# Altium schematic sheet Sheet164.SchDoc
size A2
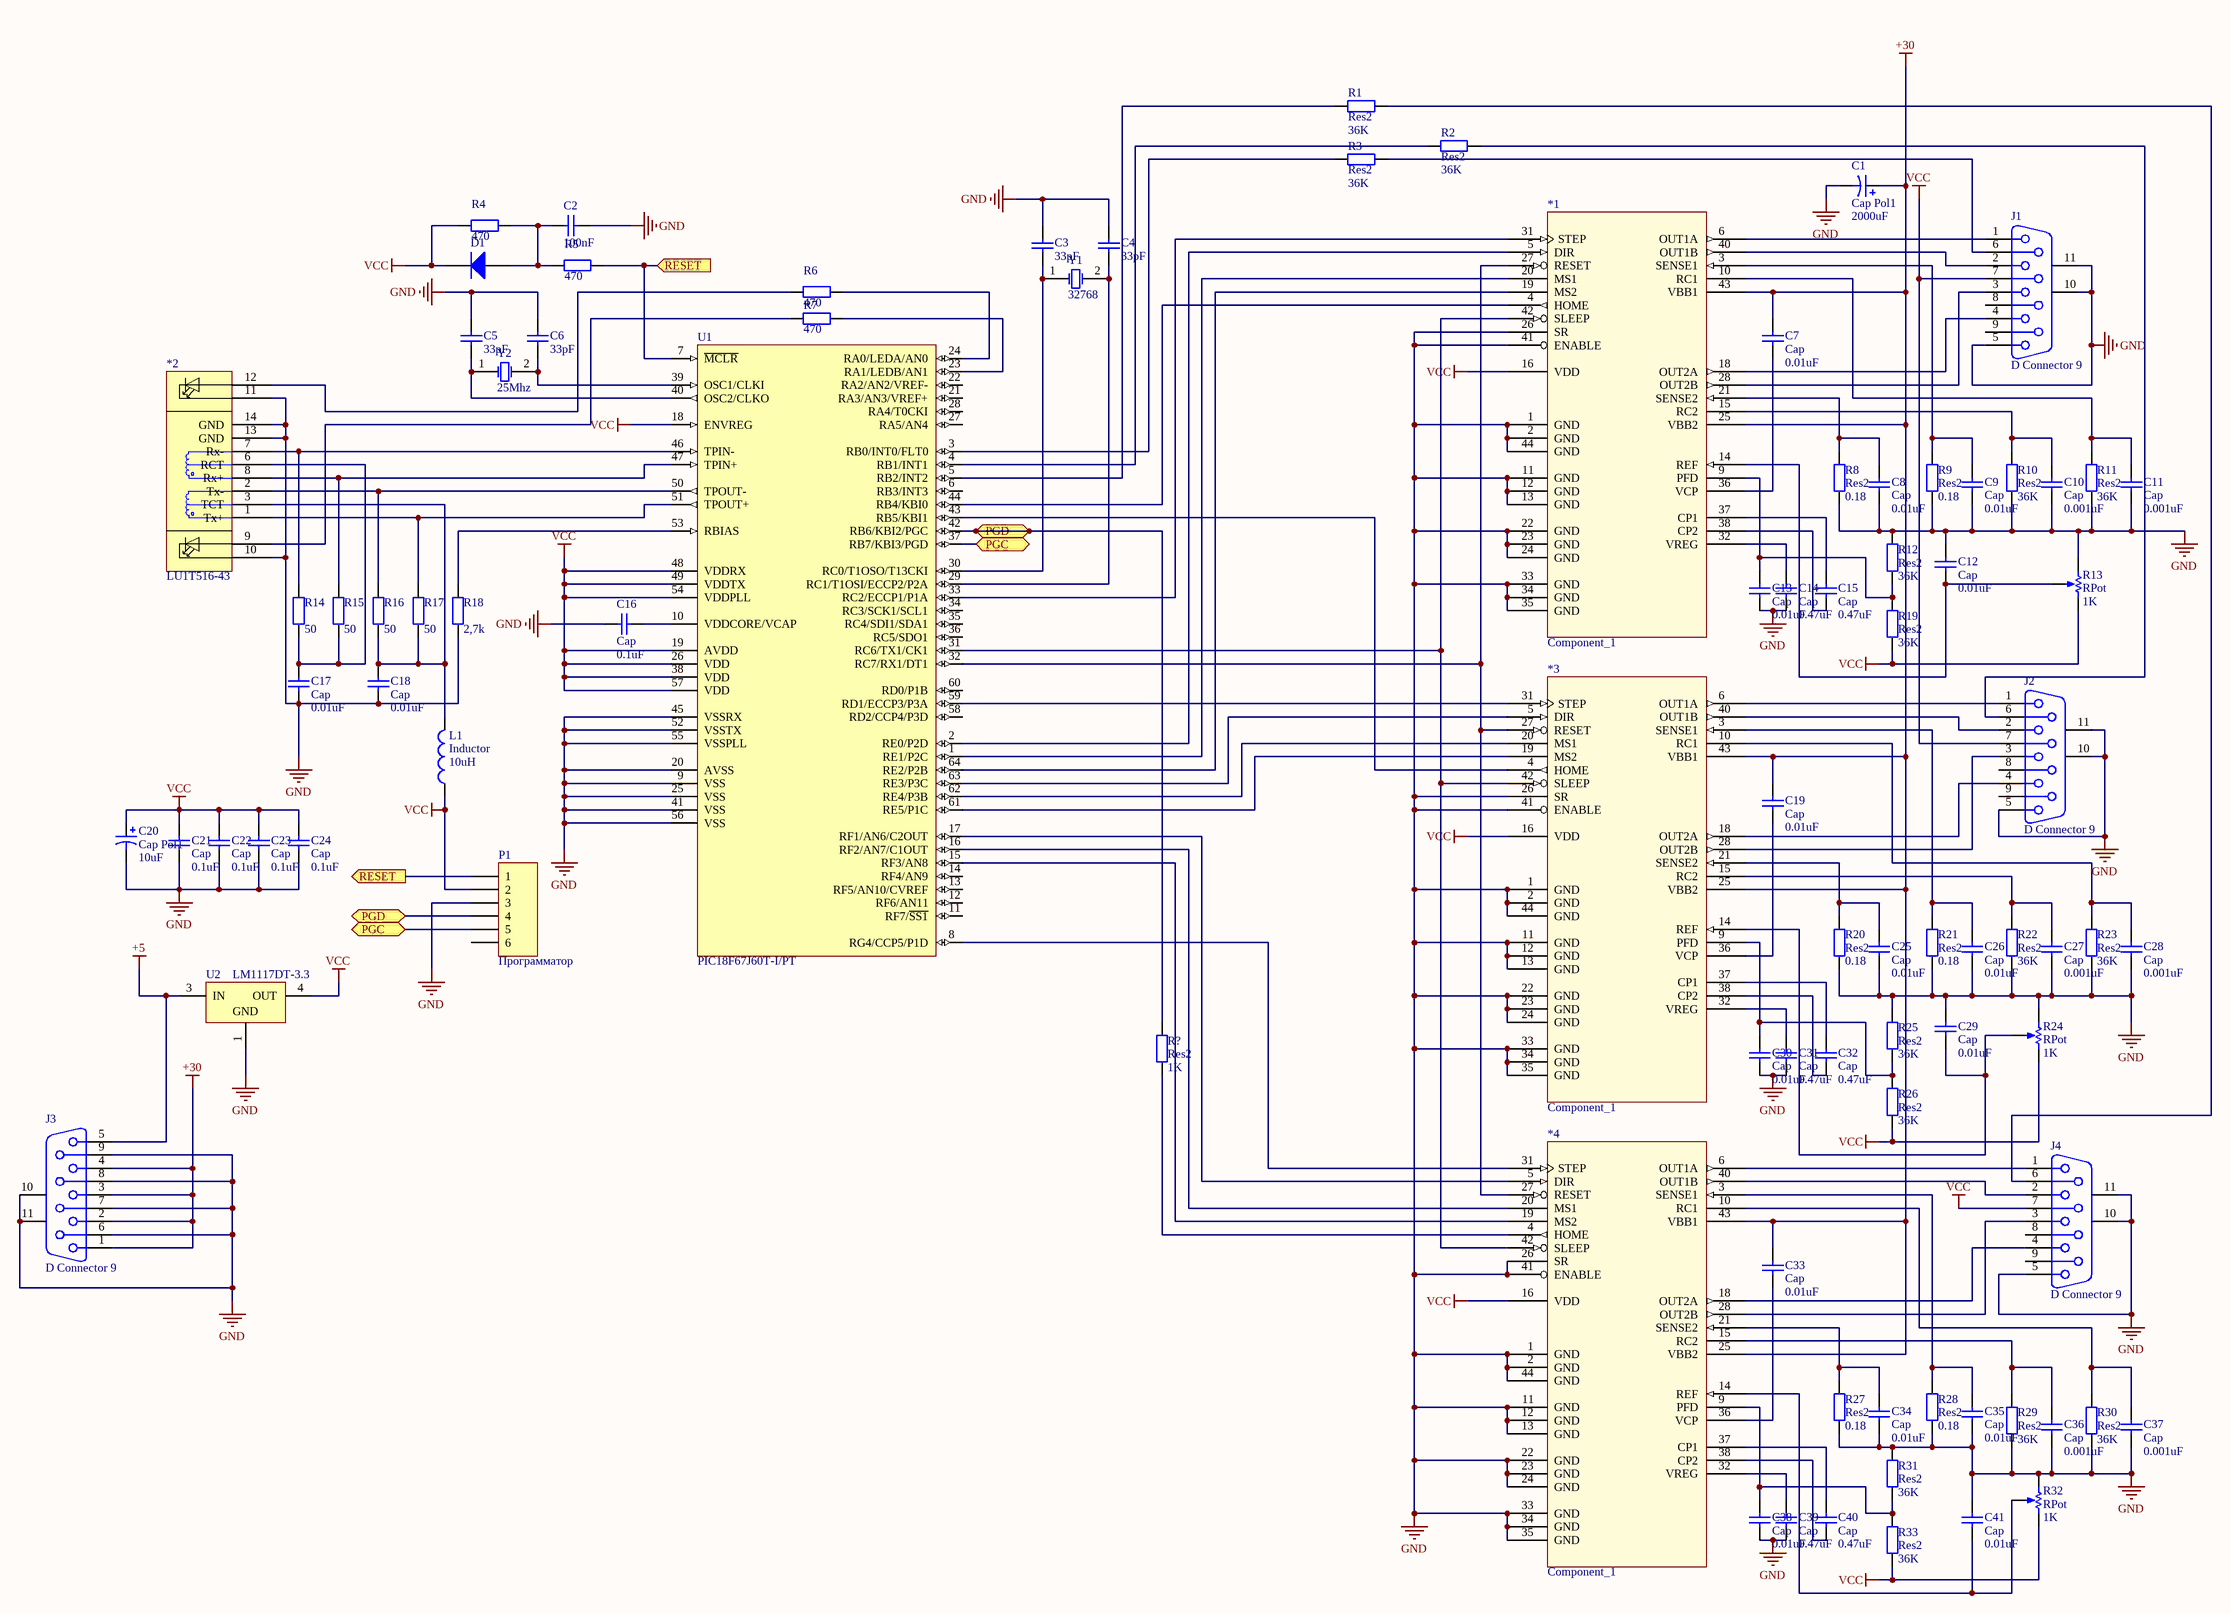
[diagram p0: Sheet164.SchDoc]

## Parts
*1  Component_1  [PLCC-44AM]
*2  LU1T516-43  [EthernetCON]
*3  Component_1  [PLCC-44AM]
*4  Component_1  [PLCC-44AM]
C1  Cap Pol1  value 2000uF  [RB7.6-15]
C2  value 100nF  [CAPC3225N]  (hidden comment: Cap)
C3  value 33pF  [CAPC2012L]  (hidden comment: Cap)
C4  value 33pF  [CAPC2012L]  (hidden comment: Cap)
C5  value 33pF  [CAPC2012L]  (hidden comment: Cap)
C6  value 33pF  [CAPC2012L]  (hidden comment: Cap)
C7  Cap  value 0.01uF  [RESC3225L]
C8  Cap  value 0.01uF  [RESC3225L]
C9  Cap  value 0.01uF  [RESC3225L]
C10  Cap  value 0.001uF  [CAPC2012L]
C11  Cap  value 0.001uF  [CAPC2012L]
C12  Cap  value 0.01uF  [CAPC2012L]
C13  Cap  value 0.01uF  [RESC2012N]
C14  Cap  value 0.47uF  [RESC3225L]
C15  Cap  value 0.47uF  [RESC3225L]
C16  Cap  value 0.1uF  [CAPC3225L]
C17  Cap  value 0.01uF  [CAPC3216L]
C18  Cap  value 0.01uF  [CAPC3216L]
C19  Cap  value 0.01uF  [RESC3225L]
C20  Cap Pol1  value 10uF  [CAPPR5-5x5]
C21  Cap  value 0.1uF  [CAPC3225L]
C22  Cap  value 0.1uF  [CAPC3225L]
C23  Cap  value 0.1uF  [CAPC3225L]
C24  Cap  value 0.1uF  [CAPC3225L]
C25  Cap  value 0.01uF  [RESC3225L]
C26  Cap  value 0.01uF  [RESC3225L]
C27  Cap  value 0.001uF  [CAPC2012L]
C28  Cap  value 0.001uF  [CAPC2012L]
C29  Cap  value 0.01uF  [CAPC2012L]
C30  Cap  value 0.01uF  [RESC2012N]
C31  Cap  value 0.47uF  [RESC3225L]
C32  Cap  value 0.47uF  [RESC3225L]
C33  Cap  value 0.01uF  [RESC3225L]
C34  Cap  value 0.01uF  [RESC3225L]
C35  Cap  value 0.01uF  [RESC3225L]
C36  Cap  value 0.001uF  [CAPC2012L]
C37  Cap  value 0.001uF  [CAPC2012L]
C38  Cap  value 0.01uF  [RESC2012N]
C39  Cap  value 0.47uF  [RESC3225L]
C40  Cap  value 0.47uF  [RESC3225L]
C41  Cap  value 0.01uF  [CAPC2012L]
D1  Diode  [SOT95P240-3N]  (value not drawn)
J1  D Connector 9  [D-SUB-9]
J2  D Connector 9  [D-SUB-9]
J3  D Connector 9  [D-SUB-9]
J4  D Connector 9  [D-SUB-9]
L1  Inductor  value 10uH  [INDC2012L]
P1  Программатор  [HDR1X6]
R1  Res2  value 36K  [RESC2012N]
R2  Res2  value 36K  [RESC2012N]
R3  Res2  value 36K  [RESC2012N]
R4  value 470  [RESC2012M]  (hidden comment: Res2)
R5  value 470  [RESC2012M]  (hidden comment: Res2)
R6  value 470  [RESC2012M]  (hidden comment: Res2)
R7  value 470  [RESC2012M]  (hidden comment: Res2)
R8  Res2  value 0.18  [AXIAL-0.5]
R9  Res2  value 0.18  [AXIAL-0.5]
R10  Res2  value 36K  [RESC2012N]
R11  Res2  value 36K  [RESC2012N]
R12  Res2  value 36K  [RESC2012N]
R13  RPot  value 1K  [VR5]
R14  value 50  [RESC2012M]  (hidden comment: Res2)
R15  value 50  [RESC2012M]  (hidden comment: Res2)
R16  value 50  [RESC2012M]  (hidden comment: Res2)
R17  value 50  [RESC2012M]  (hidden comment: Res2)
R18  value 2,7k  [RESC2012M]  (hidden comment: Res2)
R19  Res2  value 36K  [RESC2012N]
R20  Res2  value 0.18  [AXIAL-0.5]
R21  Res2  value 0.18  [AXIAL-0.5]
R22  Res2  value 36K  [RESC2012N]
R23  Res2  value 36K  [RESC2012N]
R24  RPot  value 1K  [VR5]
R25  Res2  value 36K  [RESC2012N]
R26  Res2  value 36K  [RESC2012N]
R27  Res2  value 0.18  [AXIAL-0.5]
R28  Res2  value 0.18  [AXIAL-0.5]
R29  Res2  value 36K  [RESC2012N]
R30  Res2  value 36K  [RESC2012N]
R31  Res2  value 36K  [RESC2012N]
R32  RPot  value 1K  [VR5]
R33  Res2  value 36K  [RESC2012N]
R?  Res2  value 1K  [AXIAL-0.4]
U1  PIC18F67J60T-I/PT  [TQFP-PT64_N]
U2  LM1117DT-3.3  [TD03B_N]
Y1  value 32768  [Quartz]  (hidden comment: XTAL)
Y2  value 25Mhz  [Quartz]  (hidden comment: XTAL)

## Ports
PGC (bidir), PGD (bidir), RESET (in), RESET (out)

## Nets
+5: J3.5 U2.3(IN)
+30: *1.25(VBB2) *1.43(VBB1) *3.25(VBB2) *3.43(VBB1) *4.25(VBB2) *4.43(VBB1) C1.1 C7.2 C19.2 C33.2 J3.1 J3.2 J3.3 J3.4
GND: *1.1(GND) *1.2(GND) *1.11(GND) *1.12(GND) *1.13(GND) *1.22(GND) *1.23(GND) *1.24(GND) *1.26(SR) *1.33(GND) *1.34(GND) *1.35(GND) *1.41(ENABLE) *1.44(GND) *2.10 *2.11 *2.13(GND) *2.14(GND) *3.1(GND) *3.2(GND) *3.11(GND) *3.12(GND) *3.13(GND) *3.22(GND) *3.23(GND) *3.24(GND) *3.26(SR) *3.33(GND) *3.34(GND) *3.35(GND) *3.41(ENABLE) *3.44(GND) *4.1(GND) *4.2(GND) *4.11(GND) *4.12(GND) *4.13(GND) *4.22(GND) *4.23(GND) *4.24(GND) *4.26(SR) *4.33(GND) *4.34(GND) *4.35(GND) *4.41(ENABLE) *4.44(GND) C1.2 C2.1 C3.2 C4.1 C5.2 C6.1 C8.1 C9.1 C10.1 C11.1 C12.2 C13.1 C14.1 C16.2 C17.1 C18.1 C20.2 C21.2 C22.2 C23.2 C24.2 C25.1 C26.1 C27.1 C28.1 C29.2 C30.1 C31.1 C34.1 C35.1 C36.1 C37.1 C38.1 C39.1 C41.2 J1.5 J1.10(MH1) J1.11(MH2) J2.5 J2.10(MH1) J2.11(MH2) J3.6 J3.7 J3.8 J3.9 J3.10(MH1) J3.11(MH2) J4.5 J4.10(MH1) J4.11(MH2) P1.3 R8.1 R9.1 R10.1 R11.1 R12.2 R13.1(TOP) R18.1 R20.1 R21.1 R22.1 R23.1 R24.1(TOP) R25.2 R27.1 R28.1 R29.1 R30.1 R31.2 R32.1(TOP) U1.9(VSS) U1.20(AVSS) U1.25(VSS) U1.41(VSS) U1.45(VSSRX) U1.52(VSSTX) U1.55(VSSPLL) U1.56(VSS) U2.1(GND)
VCC: *1.16(VDD) *3.16(VDD) *4.16(VDD) C20.1 C21.1 C22.1 C23.1 C24.1 D1.2(K) J1.7 J2.7 J4.7 L1.1 P1.2 R4.2 R13.2(BOT) R19.1 R24.2(BOT) R26.1 R32.2(BOT) R33.1 U1.18(ENVREG) U1.19(AVDD) U1.26(VDD) U1.38(VDD) U1.48(VDDRX) U1.49(VDDTX) U1.54(VDDPLL) U1.57(VDD) U2.4(OUT)
PGC: P1.5 U1.37(RB7/KBI3/PGD) ; port PGC
PGD: P1.4 R?.2 U1.42(RB6/KBI2/PGC) ; port PGD
RESET: P1.1 R5.1 U1.7(~{MCLR}) ; port RESET
Net*1_3: *1.3(SENSE1) C9.2 R9.2
Net*1_4: *1.4(HOME) U1.44(RB4/KBI0)
Net*1_5: *1.5(DIR) U1.2(RE0/P2D)
Net*1_6: *1.6(OUT1A) J1.1
Net*1_9: *1.9(PFD) C13.2 R12.1 R19.2
Net*1_10: *1.10(RC1) C11.2 R11.2
Net*1_14: *1.14(REF) C12.1 R13.3(TAP)
Net*1_15: *1.15(RC2) C10.2 R10.2
Net*1_18: *1.18(OUT2A) J1.4
Net*1_19: *1.19(MS2) U1.64(RE2/P2B)
Net*1_20: *1.20(MS1) U1.1(RE1/P2C)
Net*1_21: *1.21(SENSE2) C8.2 R8.2
Net*1_27: *1.27(RESET) *3.27(RESET) *4.27(RESET) U1.32(RC7/RX1/DT1)
Net*1_28: *1.28(OUT2B) J1.3
Net*1_31: *1.31(STEP) U1.33(RC2/ECCP1/P1A)
Net*1_32: *1.32(VREG) C14.2
Net*1_36: *1.36(VCP) C7.1
Net*1_37: *1.37(CP1) C15.2
Net*1_38: *1.38(CP2) C15.1
Net*1_40: *1.40(OUT1B) J1.2
Net*1_42: *1.42(SLEEP) *3.42(SLEEP) *4.42(SLEEP) U1.31(RC6/TX1/CK1)
Net*2_1: *2.1(Tx+) R17.2 U1.51(TPOUT+)
Net*2_2: *2.2(Tx-) R16.2 U1.50(TPOUT-)
Net*2_3: *2.3(TCT) C18.2 L1.2 R16.1 R17.1
Net*2_6: *2.6(RCT) C17.2 R14.1 R15.1
Net*2_7: *2.7(Rx-) R14.2 U1.46(TPIN-)
Net*2_8: *2.8(Rx+) R15.2 U1.47(TPIN+)
Net*2_9: *2.9 R7.2
Net*2_12: *2.12 R6.2
Net*3_3: *3.3(SENSE1) C26.2 R21.2
Net*3_4: *3.4(HOME) U1.43(RB5/KBI1)
Net*3_5: *3.5(DIR) U1.63(RE3/P3C)
Net*3_6: *3.6(OUT1A) J2.1
Net*3_9: *3.9(PFD) C30.2 R25.1 R26.2
Net*3_10: *3.10(RC1) C28.2 R23.2
Net*3_14: *3.14(REF) C29.1 R24.3(TAP)
Net*3_15: *3.15(RC2) C27.2 R22.2
Net*3_18: *3.18(OUT2A) J2.4
Net*3_19: *3.19(MS2) U1.61(RE5/P1C)
Net*3_20: *3.20(MS1) U1.62(RE4/P3B)
Net*3_21: *3.21(SENSE2) C25.2 R20.2
Net*3_28: *3.28(OUT2B) J2.3
Net*3_31: *3.31(STEP) U1.59(RD1/ECCP3/P3A)
Net*3_32: *3.32(VREG) C31.2
Net*3_36: *3.36(VCP) C19.1
Net*3_37: *3.37(CP1) C32.2
Net*3_38: *3.38(CP2) C32.1
Net*3_40: *3.40(OUT1B) J2.2
Net*4_3: *4.3(SENSE1) C35.2 R28.2
Net*4_4: *4.4(HOME) R?.1
Net*4_5: *4.5(DIR) U1.17(RF1/AN6/C2OUT)
Net*4_6: *4.6(OUT1A) J4.1
Net*4_9: *4.9(PFD) C38.2 R31.1 R33.2
Net*4_10: *4.10(RC1) C37.2 R30.2
Net*4_14: *4.14(REF) C41.1 R32.3(TAP)
Net*4_15: *4.15(RC2) C36.2 R29.2
Net*4_18: *4.18(OUT2A) J4.4
Net*4_19: *4.19(MS2) U1.15(RF3/AN8)
Net*4_20: *4.20(MS1) U1.16(RF2/AN7/C1OUT)
Net*4_21: *4.21(SENSE2) C34.2 R27.2
Net*4_28: *4.28(OUT2B) J4.3
Net*4_31: *4.31(STEP) U1.8(RG4/CCP5/P1D)
Net*4_32: *4.32(VREG) C39.2
Net*4_36: *4.36(VCP) C33.1
Net*4_37: *4.37(CP1) C40.2
Net*4_38: *4.38(CP2) C40.1
Net*4_40: *4.40(OUT1B) J4.2
NetC2_2: C2.2 D1.1(A) R4.1 R5.2
NetC3_1: C3.1 U1.30(RC0/T1OSO/T13CKI) Y1.1(OSC1)
NetC4_2: C4.2 U1.29(RC1/T1OSI/ECCP2/P2A) Y1.2(OSC2)
NetC5_1: C5.1 U1.40(OSC2/CLKO) Y2.1(OSC1)
NetC6_2: C6.2 U1.39(OSC1/CLKI) Y2.2(OSC2)
NetC16_1: C16.1 U1.10(VDDCORE/VCAP)
NetJ1_6: J1.6 R3.1
NetJ2_6: J2.6 R2.1
NetJ4_6: J4.6 R1.1
NetR1_2: R1.2 U1.5(RB2/INT2)
NetR2_2: R2.2 U1.4(RB1/INT1)
NetR3_2: R3.2 U1.3(RB0/INT0/FLT0)
NetR6_1: R6.1 U1.24(RA0/LEDA/AN0)
NetR7_1: R7.1 U1.23(RA1/LEDB/AN1)
NetR18_2: R18.2 U1.53(RBIAS)

Not connected (* = marked no-connect by the designer): J1 8 9; J2 8 9; J4 8 9; P1 6; U1 6(RB3/INT3) 11(RF7/~{SS1}) 12(RF6/AN11) 13(RF5/AN10/CVREF) 14(RF4/AN9) 21(RA3/AN3/VREF+) 22(RA2/AN2/VREF-) 27(RA5/AN4) 28(RA4/T0CKI) 34(RC3/SCK1/SCL1) 35(RC4/SDI1/SDA1) 36(RC5/SDO1) 58(RD2/CCP4/P3D) 60(RD0/P1B)

## Library data of the parts
C1 C20 = Cap Pol1: Polarized Capacitor (Radial); Published: 8-Jun-2000; LatestRevisionDate: 17-Jul-2002; LatestRevisionNote: Re-released for DXP Platform.; PackageReference: RB7.6-15; Publisher: Altium Limited
C2-C19 C21-C41 = Cap: Capacitor; Published: 8-Jun-2000; LatestRevisionDate: 17-Jul-2002; LatestRevisionNote: Re-released for DXP Platform.; PackageReference: RAD-0.3; Publisher: Altium Limited
D1 = Diode: Default Diode; Published: 8-Jun-2000; LatestRevisionDate: 17-Jul-2002; LatestRevisionNote: Re-released for DXP Platform.; PackageVersion: Sep-1996; PackageReference: SMC; Publisher: Altium Limited; Code_JEDEC: DO-214-AB
J1-J4 = D Connector 9: Receptacle Assembly, 9 Position, Right Angle; PackageDocument: O; Positions: 9; Published: 15-Jun-2001; LatestRevisionDate: 17-Jul-2002; LatestRevisionNote: Re-released for DXP Platform.; DatasheetDocument: 1-Sep-1999; PackageReference: 788750; Publisher: Altium Limited; Orientation: Right Angle; Gender: Receptacle
L1 = Inductor: Code_IEC: 1005; Published: 8-Jun-2000; LatestRevisionDate: 29-May-2009; LatestRevisionNote: IPC-7351 Footprint Added.; PackageReference: 0402-A; Publisher: Altium Limited; PackageDescription: Chip Inductor; Code_JEITA: 0402
P1 = Header 6: Header, 6-Pin; LatestRevisionDate: 17-Jul-2002; LatestRevisionNote: Re-released for DXP Platform.; Publisher: Altium Limited
R1-R12 R14-R23 R25-R31 R33 R? = Res2: Resistor; Published: 8-Jun-2000; LatestRevisionDate: 17-Jul-2002; LatestRevisionNote: Re-released for DXP Platform.; PackageReference: AXIAL-0.4; Publisher: Altium Limited
R13 R24 R32 = RPot: Potentiometer; Sim Note: Enter the Resistance value and the set point into parameter fields.; Set Position: 0.5; Published: 8-Jun-2000; LatestRevisionDate: 17-Jul-2002; LatestRevisionNote: Re-released for DXP Platform.; PackageReference: VR5; Publisher: Altium Limited
U1 = PIC18F67J60T-I/PT: High Performance, 1-Mbit Flash Microcontroller with Ethernet, 128K Flash, 64-Pin TQFP, Industrial Temperature Range, Tape and Reel; Published: 29-Jan-2009; DatasheetVersion: revD, Feb-2008; PackageVersion: revAW, Oct-2008; PackageReference: TQFP-PT64; Publisher: Altium Limited; PackageDescription: 64-Lead Thin Plastic Quad Flat Pack (PT) - 10x10x1mm Body, 2.00mm [TQFP]; Code_JEDEC: MS-026; ComponentLink1Description: Manufacturer Link; ComponentLink1URL: http://www.microchip.com; ComponentLink2Description: Datasheet; ComponentLink2URL: http://ww1.microchip.com/downloads/en/DeviceDoc/39762d.pdf; ComponentLink3Description: Packaging Specification; ComponentLink3URL: http://ww1.microchip.com/downloads/en/PackagingSpec/00049AW.pdf
U2 = LM1117DT-3.3: 800mA Low-Dropout Linear Regulator; Manufacturer: National Semiconductor; CompType: LDO IC; PackageTopMarking: NSUZXYTT*LM1117*DT-3.3; PowerWise: N; Published: 4-Dec-2008; DatasheetVersion: Apr-2006; PackageVersion: revC, Apr-2003; PackageReference: TD03B; Publisher: Altium Limited; PackageDescription: TO252, Molded, Jedec, 6.8 x 6.10 x 2.30mm Body, 3 Lead, 2.28mm Pitch, Surface Mount; PartNumber: LM1117DT-3.3; RoHS: O; PinCount: 3; DigiKeyPartNumber: LM1117DT-3.3-ND; Code_JEDEC: TO-252-AA; ComponentLink1Description: LM1117 Datasheet; ComponentLink1URL: http://www.national.com/ds/LM/LM1117.pdf; ComponentLink2Description: LM1117 Web Page; ComponentLink2URL: http://www.national.com/pf/LM/LM1117.html; ComponentLink3Description: TD03B Package Page; ComponentLink3URL: http://www.national.com/packaging/folders/td03b.html
Y1 Y2 = XTAL: Crystal Oscillator; Published: 8-Jun-2000; LatestRevisionDate: 17-Jul-2002; LatestRevisionNote: Re-released for DXP Platform.; PackageReference: R38; Publisher: Altium Limited